# Altium project DIOT_Template.PrjPCB (part 3 of 3)

## Sheet FPGA_Supply.SchDoc: =DocumentName
size A4; DocumentNumber: 1; Revision: 0; SheetNumber: 17; SheetTotal: 18
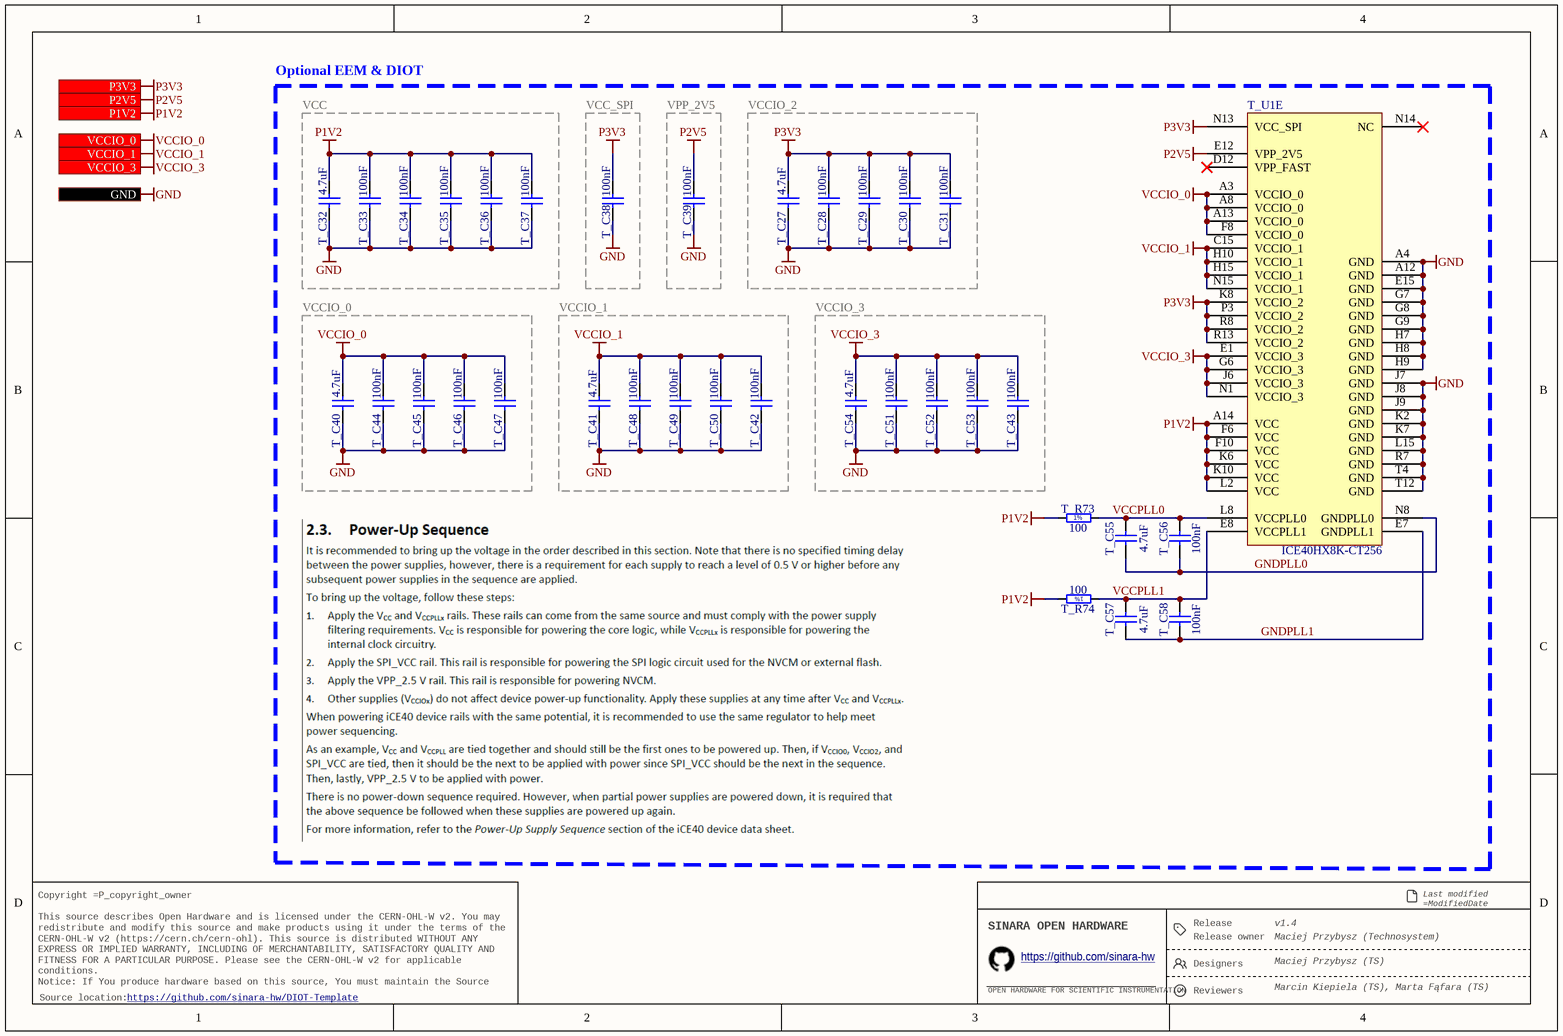
[diagram p16: FPGA_Supply.SchDoc]

### Parts
T_C27  4.7uF  [CAPC2012X135N]
T_C28  100nF  [CAPC1005X55N]
T_C29  100nF  [CAPC1005X55N]
T_C30  100nF  [CAPC1005X55N]
T_C31  100nF  [CAPC1005X55N]
T_C32  4.7uF  [CAPC2012X135N]
T_C33  100nF  [CAPC1005X55N]
T_C34  100nF  [CAPC1005X55N]
T_C35  100nF  [CAPC1005X55N]
T_C36  100nF  [CAPC1005X55N]
T_C37  100nF  [CAPC1005X55N]
T_C38  100nF  [CAPC1005X55N]
T_C39  100nF  [CAPC1005X55N]
T_C40  4.7uF  [CAPC2012X135N]
T_C41  4.7uF  [CAPC2012X135N]
T_C42  100nF  [CAPC1005X55N]
T_C43  100nF  [CAPC1005X55N]
T_C44  100nF  [CAPC1005X55N]
T_C45  100nF  [CAPC1005X55N]
T_C46  100nF  [CAPC1005X55N]
T_C47  100nF  [CAPC1005X55N]
T_C48  100nF  [CAPC1005X55N]
T_C49  100nF  [CAPC1005X55N]
T_C50  100nF  [CAPC1005X55N]
T_C51  100nF  [CAPC1005X55N]
T_C52  100nF  [CAPC1005X55N]
T_C53  100nF  [CAPC1005X55N]
T_C54  4.7uF  [CAPC2012X135N]
T_C55  4.7uF  [CAPC2012X135N]
T_C56  100nF  [CAPC1005X55N]
T_C57  4.7uF  [CAPC2012X135N]
T_C58  100nF  [CAPC1005X55N]
T_R73  100  [RESC1005X40N]
T_R74  100  [RESC1005X40N]
T_U1  ICE40HX8K-CT256  [LATC-caBGA-256]  (part E of 5)

### Blocks framed on the sheet
Optional EEM & DIOT: T_C55-T_C58 T_R73 T_R74 T_U1
VCC: T_C32-T_C37
VCC_SPI: T_C38
VPP_2V5: T_C39
VCCIO_2: T_C27-T_C31
VCCIO_0: T_C40 T_C44-T_C47
VCCIO_1: T_C41 T_C42 T_C48-T_C50
VCCIO_3: T_C43 T_C51-T_C54

### Ports
GND, P1V2 (in), P2V5 (in), P3V3 (in), VCCIO_0 (in), VCCIO_1 (in), VCCIO_3 (in)

### Nets
GND: T_C27.1 T_C28.1 T_C29.1 T_C30.1 T_C31.1 T_C32.1 T_C33.1 T_C34.1 T_C35.1 T_C36.1 T_C37.1 T_C38.1 T_C39.1 T_C40.1 T_C41.1 T_C42.1 T_C43.1 T_C44.1 T_C45.1 T_C46.1 T_C47.1 T_C48.1 T_C49.1 T_C50.1 T_C51.1 T_C52.1 T_C53.1 T_C54.1 T_U1.A4(GND) T_U1.A12(GND) T_U1.E15(GND) T_U1.G7(GND) T_U1.G8(GND) T_U1.G9(GND) T_U1.H7(GND) T_U1.H8(GND) T_U1.H9(GND) T_U1.J7(GND) T_U1.J8(GND) T_U1.J9(GND) T_U1.K2(GND) T_U1.K7(GND) T_U1.L15(GND) T_U1.R7(GND) T_U1.T4(GND) T_U1.T12(GND) ; port GND
P1V2: T_C32.2 T_C33.2 T_C34.2 T_C35.2 T_C36.2 T_C37.2 T_R73.1 T_R74.2 T_U1.A14(VCC) T_U1.F6(VCC) T_U1.F10(VCC) T_U1.K6(VCC) T_U1.K10(VCC) T_U1.L2(VCC) ; port P1V2
P2V5: T_C39.2 T_U1.E12(VPP_2V5) ; port P2V5
P3V3: T_C27.2 T_C28.2 T_C29.2 T_C30.2 T_C31.2 T_C38.2 T_U1.K8(VCCIO_2) T_U1.N13(VCC_SPI) T_U1.P3(VCCIO_2) T_U1.R8(VCCIO_2) T_U1.R13(VCCIO_2) ; port P3V3
VCCIO_0: T_C40.2 T_C44.2 T_C45.2 T_C46.2 T_C47.2 T_U1.A3(VCCIO_0) T_U1.A8(VCCIO_0) T_U1.A13(VCCIO_0) T_U1.F8(VCCIO_0) ; port VCCIO_0
VCCIO_1: T_C41.2 T_C42.2 T_C48.2 T_C49.2 T_C50.2 T_U1.C15(VCCIO_1) T_U1.H10(VCCIO_1) T_U1.H15(VCCIO_1) T_U1.N15(VCCIO_1) ; port VCCIO_1
VCCIO_3: T_C43.2 T_C51.2 T_C52.2 T_C53.2 T_C54.2 T_U1.E1(VCCIO_3) T_U1.G6(VCCIO_3) T_U1.J6(VCCIO_3) T_U1.N1(VCCIO_3) ; port VCCIO_3
GNDPLL0: T_C55.1 T_C56.1 T_U1.N8(GNDPLL0)
GNDPLL1: T_C57.1 T_C58.1 T_U1.E7(GNDPLL1)
VCCPLL0: T_C55.2 T_C56.2 T_R73.2 T_U1.L8(VCCPLL0)
VCCPLL1: T_C57.2 T_C58.2 T_R74.1 T_U1.E8(VCCPLL1)

Not connected (* = marked no-connect by the designer): T_U1 D12(VPP_FAST)* N14(NC)*

### Notes on the sheet
- Release
- Last modified =ModifiedDate
  Sheet =sheetnumber of =sheettotal · Size A4
- Copyright =P_copyright_owner
  This source describes Open Hardware and is licensed under the CERN-OHL-W v2. You may redistribute and modify this source and make products using it under the terms of the CERN-OHL-W v2 (https://cern.ch/cern-ohl). This source is distributed WITHOUT ANY EXPRESS OR IMPLIED WARRANTY, INCLUDING OF MERCHANTABILITY, SATISFACTORY QUALITY AND FITNESS FOR A PARTICULAR PURPOSE. Please see the CERN-OHL-W v2 for applicable conditions.
  Notice: If You produce hardware based on this source, You must maintain the Source Location visible on the product, its packaging or its documentation.
- SINARA OPEN HARDWARE
- OPEN HARDWARE FOR SCIENTIFIC INSTRUMENTATION
- https://github.com/sinara-hw
- Release owner
- Designers
- Reviewers
- Source location:
- (in symbol R0402_100R_1%_0.0625W_100PPM) 1%

### Library data of the parts
T_C27 T_C32 T_C40 T_C41 T_C54 T_C55 T_C57 = CC0805_4.7UF_16V_10%_X7R: Non-polarised capacitor; Part Description: SMD Multilayer Chip Ceramic Capacitor; Manufacturer: GENERIC; Manufacturer1 Part Number: EMK212B7475KG-T; Voltage: 16V; TC: X7R; Tolerance: ±10%; Part Number: CC0805_4.7UF_16V_10%_X7R; Component Kind: Standard; Component Type: Standard; Pin Count: 2; Value: 4.7uF; Status: Preferred; Manufacturer Part Number: CC0805_4.7UF_16V_10%_X7R; Case: 0805; Mounted: Yes; Socket: No; SMD: Yes; Sense: No; Manufacturer1 Example: TAIYO YUDEN; Manufacturer1 ComponentHeight: 1.35mm; HelpURL: \\cern.ch\dfs\Applications\Altium\Datasheets\CC0805_X7R_TAIYO-YUDEN_HIGH-VALUE.pdf; Author: CERN DEM JLC; CreateDate: 16.09.2014; LatestRevisionDate: 16.09.2014
T_C28-T_C31 T_C33-T_C39 T_C42-T_C53 T_C56 T_C58 = CC0402_100NF_50V_10%_X7R: Non-polarised capacitor; Part Description: SMD Multilayer Chip Ceramic Capacitor; Manufacturer: GENERIC; Manufacturer1 Part Number: GRM155R71H104KE14D; Voltage: 50V; TC: X7R; Tolerance: ±10%; Part Number: CC0402_100NF_50V_10%_X7R; Component Kind: Standard; Component Type: Standard; Pin Count: 2; Value: 100nF; Status: None; Manufacturer Part Number: CC0402_100NF_50V_10%_X7R; Case: 0402; Mounted: Yes; Socket: No; SMD: Yes; Manufacturer1 Example: MURATA; Manufacturer1 ComponentHeight: 0.55mm; HelpURL: \\cern.ch\dfs\Applications\Altium\Datasheets\CC0402_MURATA_GRM155R71H104KE14D.pdf; Author: CERN DEM MR; CreateDate: 30.06.2017; LatestRevisionDate: 30.06.2017; Sense: No
T_R73 T_R74 = R0402_100R_1%_0.0625W_100PPM: Resistor - 1%; Part Description: General Purpose Thick Film Chip Resistor; Manufacturer: GENERIC; Manufacturer1 Part Number: 232270671001L; TC: ±100ppm/°C; Table: Resistors SMD; Part Number: R0402_100R_1%_0.0625W_100PPM; Component Kind: Standard; Component Type: Standard; Pin Count: 2; Value: 100; Status: Not recommended; Power: 0.0625W; Tolerance: ±1%; Manufacturer Part Number: R0402_100R_1%_0.0625W_100PPM; Case: 0402; Mounted: Yes; Socket: No; SMD: Yes; Manufacturer1 Example: YAGEO PHYCOMP; Manufacturer1 ComponentHeight: 0.4mm; HelpURL: \\cern.ch\dfs\Applications\Altium\Datasheets\R0402_Phycomp_RC0402.pdf; Author: CERN DEM JLC; CreateDate: 2007-12-03; LatestRevisionDate: 2012-10-17
T_U1 = CMP-0962-00001-1: iCE40 HX8K Series FPGA Family, 7680 Logic Cells, 1.2 V Core, 128 K Embedded RAM Bits, 256-ball caBGA, Pb-Free, Tray; Manufacturer: Lattice Semiconductor; Supply Voltage: 1.2V; Phase-Locked Loops: 2; Logic Cells: 7680; Embedded RAM Bits: 128K; PackageReference: caBGA-256; PackageDescription: 256-Ball Chip Array Ball Grid Array, Body 14 x 14 mm, Pitch 0.8 mm; RoHS: TRUE; Packing: Tray; Mounting Technology: Surface Mount; ComponentLink3URL: http://www.latticesemi.com/lit/docs/package/pkg.pdf; ComponentLink1Description: Manufacturer URL; ComponentLink3Description: Package Specification; Code_JEDEC: MO-275; PackageVersion: Rev. 03.9, 02/2013; ComponentLink1URL: http://www.latticesemi.com/en; ComponentLink2URL: http://www.latticesemi.com/~/media/Documents/DataSheets/iCE/iCE40LPHXFamilyDataSheet.pdf; Manufacturer Part Number: ICE40HX8K-CT256; ComponentLink2Description: Datasheet; DatasheetVersion: Rev. 02.9

## Sheet FPGA_Config.SchDoc: =DocumentName
size A3; DocumentNumber: 1; Revision: 0; SheetNumber: 18; SheetTotal: 18
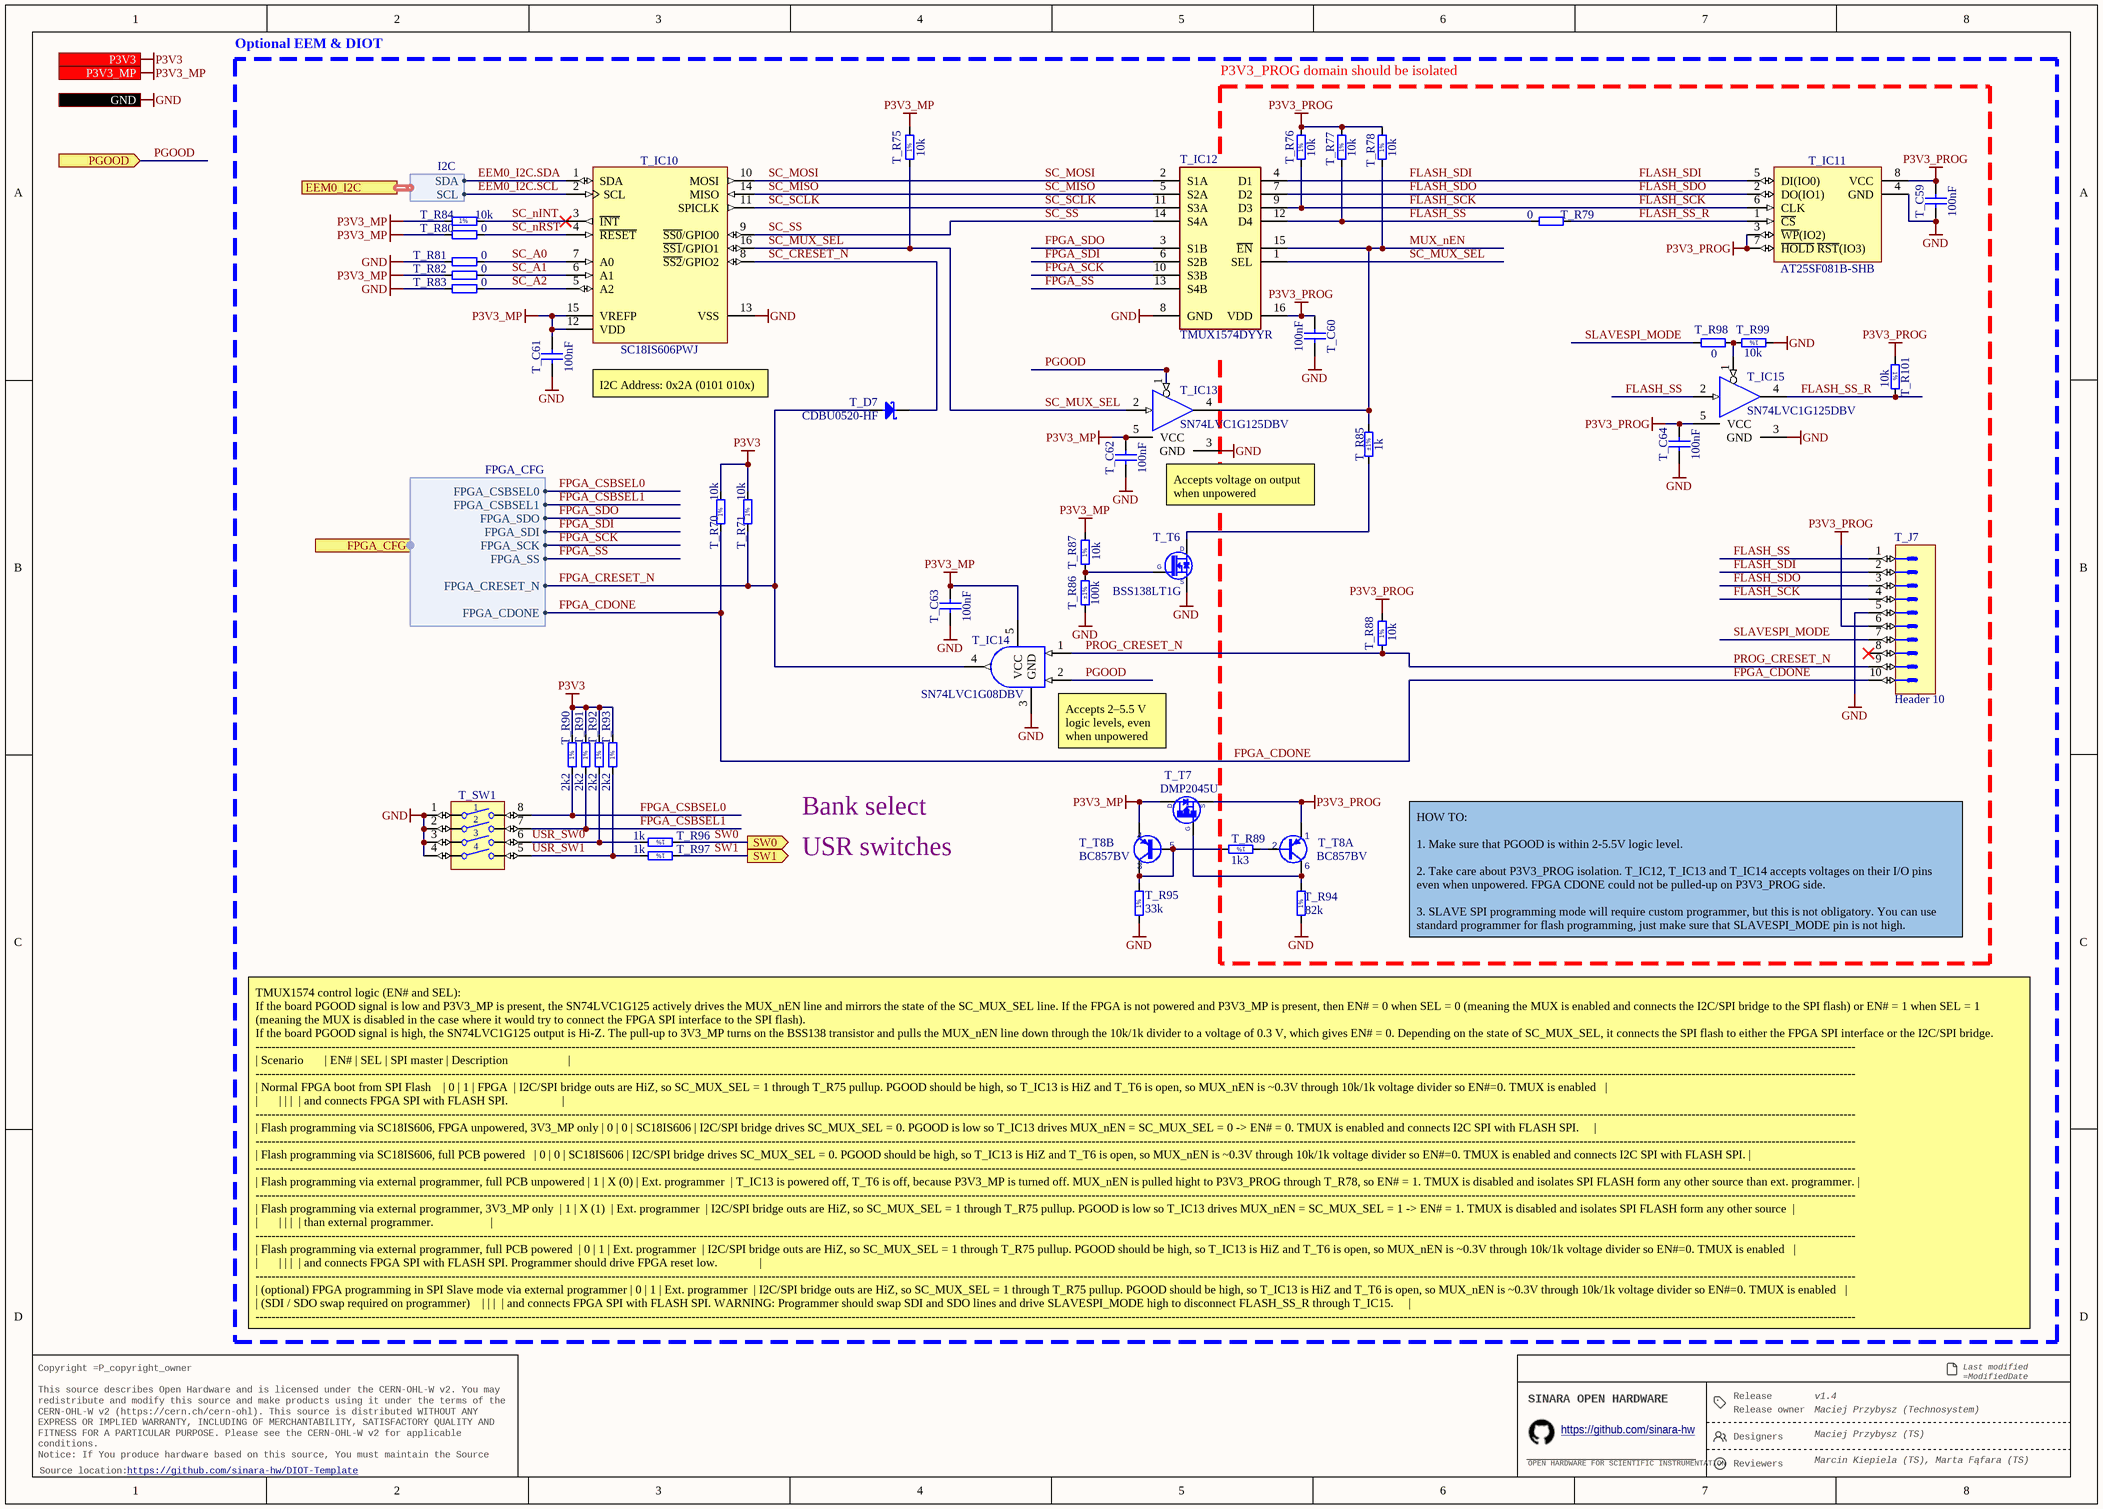
[diagram p17: FPGA_Config.SchDoc]

### Parts
T_C59  100nF  [CAPC1005X55N]
T_C60  100nF  [CAPC1005X55N]
T_C61  100nF  [CAPC1005X55N]
T_C62  100nF  [CAPC1005X55N]
T_C63  100nF  [CAPC1005X55N]
T_C64  100nF  [CAPC1005X55N]
T_D7  CDBU0520-HF  [SOD-523F]
T_IC10  SC18IS606PWJ  [SOP65P640X110-16N]
T_IC11  AT25SF081B-SHB  [SOIC127P790X216-8N]
T_IC12  TMUX1574DYYR  [SOP50P326X110-16N]
T_IC13  SN74LVC1G125DBV  [SOT95P280X145-5N]
T_IC14  SN74LVC1G08DBV  [SOT95P280X145-5N]
T_IC15  SN74LVC1G125DBV  [SOT95P280X145-5N]
T_J7  Header 10  [HARWIN_M20-9980546]
T_R70  10k  [RESC1005X40N]
T_R71  10k  [RESC1005X40N]
T_R75  10k  [RESC1005X40N]
T_R76  10k  [RESC1005X40N]
T_R77  10k  [RESC1005X40N]
T_R78  10k  [RESC1005X40N]
T_R79  0  [RESC1005X40N]
T_R80  0  [RESC1005X40N]
T_R81  0  [RESC1005X40N]
T_R82  0  [RESC1005X40N]
T_R83  0  [RESC1005X40N]
T_R84  10k  [RESC1005X40N]
T_R85  1k  Tolerance: ±1%  [RESC1005X40N]
T_R86  100k  Tolerance: ±1%  [RESC1005X40N]
T_R87  10k  [RESC1005X40N]
T_R88  10k  [RESC1005X40N]
T_R89  1k3  [RESC1608X55N]
T_R90  2k2  [RESC1005X40N]
T_R91  2k2  [RESC1005X40N]
T_R92  2k2  [RESC1005X40N]
T_R93  2k2  [RESC1005X40N]
T_R94  82k  [RESC1608X55N]
T_R95  33k  [RESC1005X40N]
T_R96  1k  [RESC1005X40N]
T_R97  1k  [RESC1005X40N]
T_R98  0  [RESC1005X40N]
T_R99  10k  [RESC1005X40N]
T_R101  10k  [RESC1005X40N]
T_SW1  Switch  [SW_TYCO_1571983-4]  (value not drawn)
T_T6  BSS138LT1G  [SOT95P240X110-3N]
T_T7  DMP2045U  [SOT95P240X110-3N]
T_T8  BC857BV  [SOTFL50P160X60-6N]  (parts A,B of 2)

### Ports
EEM0_I2C (harness I2C), FPGA_CFG (harness FPGA_CFG), GND, P3V3 (in), P3V3_MP (in), PGOOD (in), SW0 (out), SW1 (out)

### Harnesses
FPGA_CFG: FPGA_CSBSEL0, FPGA_CSBSEL1, FPGA_SDO, FPGA_SDI, FPGA_SCK, FPGA_SS, FPGA_CRESET_N, FPGA_CDONE
I2C: SDA, SCL

### Nets
GND: T_C59.1 T_C60.1 T_C61.1 T_C62.1 T_C63.1 T_C64.1 T_IC10.13(VSS) T_IC11.4(GND) T_IC12.8(GND) T_IC13.3(GND) T_IC14.3(GND) T_IC15.3(GND) T_J7.5 T_R81.2 T_R83.2 T_R86.2 T_R94.1 T_R95.1 T_R99.1 T_SW1.1 T_SW1.2 T_SW1.3 T_SW1.4 T_T6.2(S) ; port GND
P3V3: T_R70.2 T_R71.2 T_R90.2 T_R91.2 T_R92.2 T_R93.2 ; port P3V3
P3V3_MP: T_C61.2 T_C62.2 T_C63.2 T_IC10.12(VDD) T_IC10.15(VREFP) T_IC13.5(VCC) T_IC14.5(VCC) T_R75.2 T_R80.2 T_R82.2 T_R84.1 T_R87.2 T_T7.3(D) T_T8.4(E) ; port P3V3_MP
P3V3_PROG: T_C59.2 T_C60.2 T_C64.2 T_IC11.3(~{WP}(IO2)) T_IC11.7(~{HOLD}_~{RST}(IO3)) T_IC11.8(VCC) T_IC12.16(VDD) T_IC15.5(VCC) T_J7.6 T_R76.2 T_R77.2 T_R78.2 T_R88.2 T_R101.1 T_T7.2(S) T_T8.1(E)
EEM0_I2C.SCL: T_IC10.2(SCL) ; port EEM0_I2C.SCL
EEM0_I2C.SDA: T_IC10.1(SDA) ; port EEM0_I2C.SDA
FLASH_SCK: T_IC11.6(CLK) T_IC12.9(D3) T_J7.4 T_R76.1
FLASH_SDI: T_IC11.5(DI(IO0)) T_IC12.4(D1) T_J7.2
FLASH_SDO: T_IC11.2(DO(IO1)) T_IC12.7(D2) T_J7.3
FLASH_SS: T_IC12.12(D4) T_IC15.2(IN) T_J7.1 T_R77.1 T_R79.1
FLASH_SS_R: T_IC11.1(~{CS}) T_IC15.4(OUT) T_R79.2 T_R101.2
FPGA_CDONE: T_J7.10 T_R70.1 ; port FPGA_CFG.FPGA_CDONE  [project net FPGA_CFG.FPGA_CDONE]
FPGA_CRESET_N: T_D7.2(A) T_IC14.4(Y) T_R71.1 ; port FPGA_CFG.FPGA_CRESET_N  [project net FPGA_CFG.FPGA_CRESET_N]
FPGA_CSBSEL0: T_R90.1 T_SW1.8 ; port FPGA_CFG.FPGA_CSBSEL0  [project net FPGA_CFG.FPGA_CSBSEL0]
FPGA_CSBSEL1: T_R91.1 T_SW1.7 ; port FPGA_CFG.FPGA_CSBSEL1  [project net FPGA_CFG.FPGA_CSBSEL1]
FPGA_SCK: T_IC12.10(S3B) ; port FPGA_CFG.FPGA_SCK  [project net FPGA_CFG.FPGA_SCK]
FPGA_SDI: T_IC12.6(S2B) ; port FPGA_CFG.FPGA_SDI  [project net FPGA_CFG.FPGA_SDI]
FPGA_SDO: T_IC12.3(S1B) ; port FPGA_CFG.FPGA_SDO  [project net FPGA_CFG.FPGA_SDO]
FPGA_SS: T_IC12.13(S4B) ; port FPGA_CFG.FPGA_SS  [project net FPGA_CFG.FPGA_SS]
MUX_nEN: T_IC12.15(~{EN}) T_IC13.4(OUT) T_R78.1 T_R85.2
PGOOD: T_IC13.1(~{G}) T_IC14.2(B) ; port PGOOD
PROG_CRESET_N: T_IC14.1(A) T_J7.9 T_R88.1
SC_A0: T_IC10.7(A0) T_R81.1
SC_A1: T_IC10.6(A1) T_R82.1
SC_A2: T_IC10.5(A2) T_R83.1
SC_CRESET_N: T_D7.1(C) T_IC10.8(~{SS2}/GPIO2)
SC_MISO: T_IC10.14(MISO) T_IC12.5(S2A)
SC_MOSI: T_IC10.10(MOSI) T_IC12.2(S1A)
SC_MUX_SEL: T_IC10.16(~{SS1}/GPIO1) T_IC12.1(SEL) T_IC13.2(IN) T_R75.1
SC_nINT: T_IC10.3(~{INT}) T_R84.2
SC_nRST: T_IC10.4(~{RESET}) T_R80.1
SC_SCLK: T_IC10.11(SPICLK) T_IC12.11(S3A)
SC_SS: T_IC10.9(~{SS0}/GPIO0) T_IC12.14(S4A)
SLAVESPI_MODE: T_J7.7 T_R98.1
SW0: T_R96.1 ; port SW0
SW1: T_R97.1 ; port SW1
USR_SW0: T_R92.1 T_R96.2 T_SW1.6
USR_SW1: T_R93.1 T_R97.2 T_SW1.5
NetT_IC15_1: T_IC15.1(~{G}) T_R98.2 T_R99.2
NetT_R85_1: T_R85.1 T_T6.3(D)
NetT_R86_1: T_R86.1 T_R87.1 T_T6.1(G)
NetT_R89_1: T_R89.1 T_T8.2(B)
NetT_R89_2: T_R89.2 T_R95.2 T_T8.3(C) T_T8.5(B)
NetT_R94_2: T_R94.2 T_T7.1(G) T_T8.6(C)

Not connected (* = marked no-connect by the designer): T_J7 8*

### Notes on the sheet
- Optional EEM & DIOT
- P3V3_PROG domain should be isolated
- I2C Address: 0x2A (0101 010x)
- (near T_IC13) Accepts voltage on output when unpowered
- (near T_IC14) Accepts 2–5.5 V logic levels, even when unpowered
- Bank select
- USR switches
- HOW TO:
  1. Make sure that PGOOD is within 2-5.5V logic level.
  2. Take care about P3V3_PROG isolation. T_IC12, T_IC13 and T_IC14 accepts voltages on their I/O pins even when unpowered. FPGA CDONE could not be pulled-up on P3V3_PROG side.
  3. SLAVE SPI programming mode will require custom programmer, but this is not obligatory. You can use standard programmer for flash programming, just make sure that SLAVESPI_MODE pin is not high.
- TMUX1574 control logic (EN# and SEL):
  If the board PGOOD signal is low and P3V3_MP is present, the SN74LVC1G125 actively drives the MUX_nEN line and mirrors the state of the SC_MUX_SEL line. If the FPGA is not powered and P3V3_MP is present, then EN# = 0 when SEL = 0 (meaning the MUX is enabled and connects the I2C/SPI bridge to the SPI flash) or EN# = 1 when SEL = 1 (meaning the MUX is disabled in the case where it would try to connect the FPGA SPI interface to the SPI flash).
  If the board PGOOD signal is high, the SN74LVC1G125 output is Hi-Z. The pull-up to 3V3_MP turns on the BSS138 transistor and pulls the MUX_nEN line down through the 10k/1k divider to a voltage of 0.3 V, which gives EN# = 0. Depending on the state of SC_MUX_SEL, it connects the SPI flash to either the FPGA SPI interface or the I2C/SPI bridge.
  -------------------------------------------------------------------------------------------------------------------------------------------------------------------------------------------------------------------------------------------------------------------------------------------------------------------------------------------------------------------------------------------------------------------------------------------------
  | Scenario							| EN#	| SEL	| SPI master	| Description																				|
  -------------------------------------------------------------------------------------------------------------------------------------------------------------------------------------------------------------------------------------------------------------------------------------------------------------------------------------------------------------------------------------------------------------------------------------------------
  | Normal FPGA boot from SPI Flash				| 0	| 1	| FPGA		| I2C/SPI bridge outs are HiZ, so SC_MUX_SEL = 1 through T_R75 pullup. PGOOD should be high, so T_IC13 is HiZ and T_T6 is open, so MUX_nEN is ~0.3V through 10k/1k voltage divider so EN#=0. TMUX is enabled 		|
  |							|	|	|		| and connects FPGA SPI with FLASH SPI.																		|
  -------------------------------------------------------------------------------------------------------------------------------------------------------------------------------------------------------------------------------------------------------------------------------------------------------------------------------------------------------------------------------------------------------------------------------------------------
  | Flash programming via SC18IS606, FPGA unpowered, 3V3_MP only	| 0	| 0	| SC18IS606	| I2C/SPI bridge drives SC_MUX_SEL = 0. PGOOD is low so T_IC13 drives MUX_nEN = SC_MUX_SEL = 0 -> EN# = 0. TMUX is enabled and connects I2C SPI with FLASH SPI.					|
  -------------------------------------------------------------------------------------------------------------------------------------------------------------------------------------------------------------------------------------------------------------------------------------------------------------------------------------------------------------------------------------------------------------------------------------------------
  | Flash programming via SC18IS606, full PCB powered			| 0	| 0	| SC18IS606	| I2C/SPI bridge drives SC_MUX_SEL = 0. PGOOD should be high, so T_IC13 is HiZ and T_T6 is open, so MUX_nEN is ~0.3V through 10k/1k voltage divider so EN#=0. TMUX is enabled and connects I2C SPI with FLASH SPI.	|
  -------------------------------------------------------------------------------------------------------------------------------------------------------------------------------------------------------------------------------------------------------------------------------------------------------------------------------------------------------------------------------------------------------------------------------------------------
  | Flash programming via external programmer, full PCB unpowered	| 1	| X (0)	| Ext. programmer 	| T_IC13 is powered off, T_T6 is off, because P3V3_MP is turned off. MUX_nEN is pulled hight to P3V3_PROG through T_R78, so EN# = 1. TMUX is disabled and isolates SPI FLASH form any other source than ext. programmer.	|
  -------------------------------------------------------------------------------------------------------------------------------------------------------------------------------------------------------------------------------------------------------------------------------------------------------------------------------------------------------------------------------------------------------------------------------------------------
  | Flash programming via external programmer, 3V3_MP only		| 1	| X (1) 	| Ext. programmer 	| I2C/SPI bridge outs are HiZ, so SC_MUX_SEL = 1 through T_R75 pullup. PGOOD is low so T_IC13 drives MUX_nEN = SC_MUX_SEL = 1 -> EN# = 1. TMUX is disabled and isolates SPI FLASH form any other source		|
  |							|	|	|		| than external programmer.																			|
  -------------------------------------------------------------------------------------------------------------------------------------------------------------------------------------------------------------------------------------------------------------------------------------------------------------------------------------------------------------------------------------------------------------------------------------------------
  | Flash programming via external programmer, full PCB powered		| 0	| 1	| Ext. programmer 	| I2C/SPI bridge outs are HiZ, so SC_MUX_SEL = 1 through T_R75 pullup. PGOOD should be high, so T_IC13 is HiZ and T_T6 is open, so MUX_nEN is ~0.3V through 10k/1k voltage divider so EN#=0. TMUX is enabled 		|
  |							|	|	|		| and connects FPGA SPI with FLASH SPI. Programmer should drive FPGA reset low.														|
  -------------------------------------------------------------------------------------------------------------------------------------------------------------------------------------------------------------------------------------------------------------------------------------------------------------------------------------------------------------------------------------------------------------------------------------------------
  | (optional) FPGA programming in SPI Slave mode via external programmer	| 0	| 1	| Ext. programmer 	| I2C/SPI bridge outs are HiZ, so SC_MUX_SEL = 1 through T_R75 pullup. PGOOD should be high, so T_IC13 is HiZ and T_T6 is open, so MUX_nEN is ~0.3V through 10k/1k voltage divider so EN#=0. TMUX is enabled 		|
  | (SDI / SDO swap required on programmer)				|	|	|		| and connects FPGA SPI with FLASH SPI. WARNING: Programmer should swap SDI and SDO lines and drive SLAVESPI_MODE high to disconnect FLASH_SS_R through T_IC15.					|
  -------------------------------------------------------------------------------------------------------------------------------------------------------------------------------------------------------------------------------------------------------------------------------------------------------------------------------------------------------------------------------------------------------------------------------------------------
- Release
- Last modified =ModifiedDate
  Sheet =sheetnumber of =sheettotal · Size A3
- Copyright =P_copyright_owner
  This source describes Open Hardware and is licensed under the CERN-OHL-W v2. You may redistribute and modify this source and make products using it under the terms of the CERN-OHL-W v2 (https://cern.ch/cern-ohl). This source is distributed WITHOUT ANY EXPRESS OR IMPLIED WARRANTY, INCLUDING OF MERCHANTABILITY, SATISFACTORY QUALITY AND FITNESS FOR A PARTICULAR PURPOSE. Please see the CERN-OHL-W v2 for applicable conditions.
  Notice: If You produce hardware based on this source, You must maintain the Source Location visible on the product, its packaging or its documentation.
- SINARA OPEN HARDWARE
- OPEN HARDWARE FOR SCIENTIFIC INSTRUMENTATION
- https://github.com/sinara-hw
- Release owner
- Designers
- Reviewers
- Source location:
- (in symbol R0402_1K_1%_0.0625W_100PPM) 1%
- (in symbol R0402_2K2_1%_0.0625W_100PPM) 1%
- (in symbol R0402_10K_1%_0.0625W_100PPM) 1%
- (in symbol R0402_33K_1%_0.0625W_100PPM) 1%
- (in symbol R0603_1K3_1%_0.1W_100PPM) 1%
- (in symbol R0603_82K_1%_0.1W_100PPM) 1%

### Library data of the parts
T_C59-T_C64 = CC0402_100NF_50V_10%_X7R: as T_C28 on sheet FPGA_Supply; Part Number: CC0402_100NF_50V_10%_X7R; Component Kind: Standard; Component Type: Standard; Pin Count: 2; Value: 100nF; Status: None; Manufacturer Part Number: CC0402_100NF_50V_10%_X7R; Case: 0402; Mounted: Yes; Socket: No; SMD: Yes; Sense: No; Manufacturer1 Example: MURATA; Manufacturer1 ComponentHeight: 0.55mm; HelpURL: \\cern.ch\dfs\Applications\Altium\Datasheets\CC0402_MURATA_GRM155R71H104KE14D.pdf; Author: CERN DEM MR; CreateDate: 30.06.2017; LatestRevisionDate: 30.06.2017
T_D7 = CDBU0520-HF: Schottky Diode; Part Description: 20V Surface mount Schottky Barrier Diode; Manufacturer: COMCHIP; Voltage: 20V; Power: 500mA; PressFit: No; Bonding: No; Part Number: CDBU0520-HF; Component Kind: Standard; Component Type: Standard; Device: CDBU0520-HF; PackageDescription: Small Outline Diode Flat Lead (SOD-523F), Body; 1.80mm L X 1mm W X 0.85mm H; Manufacturer Part Number: CDBU0520-HF; Pin Count: 2; Case: SOD-523F; Mounted: Yes; Socket: No; SMD: Yes; Sense: No; ComponentHeight: 1mm; HelpURL: \\cern.ch\dfs\Applications\Altium\Datasheets\CDBU0520-HF.pdf; Author: CERN DEM HF; CreateDate: 13.10.2023; LatestRevisionDate: 13.10.2023
T_IC10 = SC18IS606PWJ: I2C-bus to SPI bridge; Manufacturer: NXP SEMICONDUCTORS; PressFit: No; Bonding: No; Part Number: SC18IS606PWJ; Component Kind: Standard; Component Type: Standard; Device: SC18IS606PWJ; PackageDescription: SOP, 0.65mm pitch; 16 pin, 4.40mm W X 5.00mm L X 1.10mm H body IPC Medium Density; Part Description: I2C-Bus to SPI Bridge; Manufacturer Part Number: SC18IS606PWJ; Pin Count: 16; Case: TSSOP16; Mounted: Yes; Socket: No; SMD: Yes; Sense: No; ComponentHeight: 1.1mm; HelpURL: \\cern.ch\dfs\Applications\Altium\Datasheets\SC18IS602B.pdf; Author: GK; CreateDate: 14/12/2015; LatestRevisionDate: 14/12/2015
T_IC11 = MEM_AT25SF081B-SHB: 8M-bit Serial Flash Memory with uniform 4KB sectors and Dual/Quad SPI and QPI; Manufacturer: Renesas; PressFit: No; Bonding: No; Part Number: AT25SF081B-SHB; Component Kind: Standard; Component Type: Standard; Device: AT25SF081B-SHB; PackageDescription: SOIC, 1.27mm Pitch; 8 Pin, 5.285mm W X 5.335mm L X 2.16mm H body, IPC Medium Density; Part Description: 8M-bit Serial Flash Memory with uniform 4KB sectors and Dual/Quad SPI and QPI; Manufacturer Part Number: AT25SF081B-SHB; Pin Count: 8; Case: SOIC8; Mounted: Yes; Socket: No; SMD: Yes; Sense: No; ComponentHeight: 2.16mm; HelpURL: \\cern.ch\dfs\Applications\Altium\Datasheets\W25Q128FVSIG.pdf; Author: GK; CreateDate: 26/01/2018; LatestRevisionDate: 26/01/2018
T_IC12 = TMUX1574DYYR: Integrated Circuit; Manufacturer_Name: Texas Instruments; Datasheet Link: https://www.ti.com/lit/gpn/TMUX1574; Height: 1.1mm; Manufacturer_Part_Number: TMUX1574DYYR; Mouser Part Number: 595-TMUX1574DYYR; Mouser Price/Stock: https://www.mouser.co.uk/ProductDetail/Texas-Instruments/TMUX1574DYYR?qs=B6kkDfuK7%2FDgs0e8M6dtlw%3D%3D; Arrow Part Number: TMUX1574DYYR; Arrow Price/Stock: https://www.arrow.com/en/products/tmux1574dyyr/texas-instruments.html?utm_currency=USD&region=nac
T_IC13 T_IC15 = SN74LVC1G125DBV: Single Bus Buffer Gate With 3-State Output; Part Description: Single Bus Buffer Gate with 3-State Outputs; Manufacturer: TEXAS INSTRUMENTS; PressFit: No; Bonding: No; Part Number: SN74LVC1G125DBV; Component Kind: Standard; Component Type: Standard; Device: SN74LVC1G125DBV; PackageDescription: SOT, 0.95mm Pitch; 5 Pin, 1.60mm W X 2.90mm L X 1.45mm H body, IPC Medium Density; Manufacturer Part Number: SN74LVC1G125DBV; Pin Count: 5; Case: SOT23-5; Mounted: Yes; Socket: No; SMD: Yes; Sense: No; ComponentHeight: 1.45mm; Author: CERN DEM HF; HelpURL: \\cern.ch\dfs\Applications\Altium\Datasheets\SN74LVC1G125.pdf; CreateDate: 15.11.2022; LatestRevisionDate: 15.11.2022
T_IC14 = SN74LVC1G08DBV: Single 2-Input AND Gate; Part Description: Single 2-Input Positive-AND Gate; Manufacturer: TEXAS INSTRUMENTS; PressFit: No; Bonding: No; Part Number: SN74LVC1G08DBV; Component Kind: Standard; Component Type: Standard; Device: SN74LVC1G08DBV; PackageDescription: SOT, 0.95mm Pitch; 5 Pin, 1.60mm W X 2.90mm L X 1.45mm H body, IPC Medium Density; Manufacturer Part Number: SN74LVC1G08DBV; Pin Count: 5; Case: SOT23-5; Mounted: Yes; Socket: No; SMD: Yes; Sense: No; ComponentHeight: 1.45mm; Author: CERN DEM JLC; HelpURL: \\cern.ch\dfs\Applications\Altium\Datasheets\SN74LVC1G08.pdf; CreateDate: 28.08.2012; LatestRevisionDate: 27.10.2021
T_J7 = HARWIN_M20-9980546: Connector 10 Male; Part Description: 10 Contacts - Pitch 2.54mm - Dual Row Straight Header (Lead Length 6.1mm, Insulator 2.54mm); Manufacturer: HARWIN; PressFit: No; Part Number: HARWIN_M20-9980546; Component Kind: Standard; Component Type: Standard; Pin Count: 10; Family: Header 10; Mounted: Yes; Socket: No; SMD: No; Sense: No; Status: None; Manufacturer Part Number: M20-9980546; ComponentHeight: 8.64mm; HelpURL: \\cern.ch\dfs\Applications\Altium\Datasheets\HARWIN_M20-9980546.pdf; Author: CERN DEM MR; CreateDate: 9/15/2017; LatestRevisionDate: 9/15/2017
T_R70 T_R71 = R0402_10K_1%_0.0625W_100PPM: Resistor - 1%; Part Description: General Purpose Thick Film Chip Resistor; Manufacturer: GENERIC; Manufacturer1 Part Number: 232270671003L; TC: ±100ppm/°C; PressFit: No; Part Number: R0402_10K_1%_0.0625W_100PPM; Component Kind: Standard; Component Type: Standard; Pin Count: 2; Value: 10k; Status: Not Recommended; Power: 0.0625W; Tolerance: ±1%; Manufacturer Part Number: R0402_10K_1%_0.0625W_100PPM; Case: 0402; Mounted: Yes; Sense: No; Socket: No; SMD: Yes; Manufacturer1 Example: YAGEO PHYCOMP; Manufacturer1 ComponentHeight: 0.4mm; HelpURL: \\cern.ch\dfs\Applications\Altium\Datasheets\R0402_Phycomp_RC0402.pdf; Author: CERN DEM JLC; CreateDate: 03.12.2007; LatestRevisionDate: 17.10.2012
T_R75-T_R78 T_R84 T_R87 T_R88 T_R99 T_R101 = R0402_10K_1%_0.0625W_100PPM: Resistor - 1%; Part Description: General Purpose Thick Film Chip Resistor; Manufacturer: GENERIC; Manufacturer1 Part Number: 232270671003L; TC: ±100ppm/°C; Table: Resistors SMD; Part Number: R0402_10K_1%_0.0625W_100PPM; Component Kind: Standard; Component Type: Standard; Pin Count: 2; Value: 10k; Status: Not recommended; Power: 0.0625W; Tolerance: ±1%; Manufacturer Part Number: R0402_10K_1%_0.0625W_100PPM; Case: 0402; Mounted: Yes; Socket: No; SMD: Yes; Manufacturer1 Example: YAGEO PHYCOMP; Manufacturer1 ComponentHeight: 0.4mm; HelpURL: \\cern.ch\dfs\Applications\Altium\Datasheets\R0402_Phycomp_RC0402.pdf; Author: CERN DEM JLC; CreateDate: 2007-12-03; LatestRevisionDate: 2012-10-17
T_R79-T_R83 T_R98 = R0402_0R_JUMPER: Resistor; Part Description: 1A (0.05R Max DC Resistance) Zero Ohm Jumper; Manufacturer: GENERIC; Manufacturer1 Part Number: 232270591001L; PressFit: No; Part Number: R0402_0R_JUMPER; Component Kind: Standard; Component Type: Standard; Pin Count: 2; Value: 0; Status: Not Recommended; Manufacturer Part Number: R0402_0R_JUMPER; Case: 0402; Mounted: Yes; Sense: No; Socket: No; SMD: Yes; Manufacturer1 Example: YAGEO PHYCOMP; Manufacturer1 ComponentHeight: 0.4mm; HelpURL: \\cern.ch\dfs\Applications\Altium\Datasheets\R0402_Phycomp_RC0402.pdf; Author: CERN DEM JLC; CreateDate: 03.12.2007; LatestRevisionDate: 17.10.2012
T_R85 T_R96 T_R97 = R0402_1K_1%_0.0625W_100PPM: Resistor - 1%; Part Description: General Purpose Thick Film Chip Resistor; Manufacturer: GENERIC; Manufacturer1 Part Number: 232270671002L; TC: ±100ppm/°C; PressFit: No; Part Number: R0402_1K_1%_0.0625W_100PPM; Component Kind: Standard; Component Type: Standard; Pin Count: 2; Value: 1k; Status: Not Recommended; Power: 0.0625W; Manufacturer Part Number: R0402_1K_1%_0.0625W_100PPM; Case: 0402; Mounted: Yes; Sense: No; Socket: No; SMD: Yes; Manufacturer1 Example: YAGEO PHYCOMP; Manufacturer1 ComponentHeight: 0.4mm; HelpURL: \\cern.ch\dfs\Applications\Altium\Datasheets\R0402_Phycomp_RC0402.pdf; Author: CERN DEM JLC; CreateDate: 03.12.2007; LatestRevisionDate: 17.10.2012
  T_R96 T_R97: Tolerance: ±1%
T_R86 = R0402_100K_1%_0.0625W_100PPM: Resistor - 1%; Part Description: General Purpose Thick Film Chip Resistor; Manufacturer: GENERIC; Manufacturer1 Part Number: 232270671004L; TC: ±100ppm/°C; PressFit: No; Part Number: R0402_100K_1%_0.0625W_100PPM; Component Kind: Standard; Component Type: Standard; Pin Count: 2; Value: 100k; Status: Not Recommended; Power: 0.0625W; Manufacturer Part Number: R0402_100K_1%_0.0625W_100PPM; Case: 0402; Mounted: Yes; Sense: No; Socket: No; SMD: Yes; Manufacturer1 Example: YAGEO PHYCOMP; Manufacturer1 ComponentHeight: 0.4mm; HelpURL: \\cern.ch\dfs\Applications\Altium\Datasheets\R0402_Phycomp_RC0402.pdf; Author: CERN DEM JLC; CreateDate: 03.12.2007; LatestRevisionDate: 17.10.2012
T_R89 = R0603_1K3_1%_0.1W_100PPM: Resistor - 1%; Part Description: General Purpose Thick Film Chip Resistor; Manufacturer: GENERIC; Manufacturer1 Part Number: NRC06F1301TRF; Power: 0.1W; TC: ±100ppm/°C; PressFit: No; Part Number: R0603_1K3_1%_0.1W_100PPM; Component Kind: Standard; Component Type: Standard; Pin Count: 2; Value: 1k3; Status: Preferred; Tolerance: ±1%; Manufacturer Part Number: R0603_1K3_1%_0.1W_100PPM; Case: 0603; Mounted: Yes; Sense: No; Socket: No; SMD: Yes; Manufacturer1 Example: NIC COMPONENT; Manufacturer1 ComponentHeight: 0.55mm; HelpURL: \\cern.ch\dfs\Applications\Altium\Datasheets\R0603_NIC_NRC.pdf; Author: CERN DEM JLC; CreateDate: 03.12.2007; LatestRevisionDate: 13.03.2008
T_R90-T_R93 = R0402_2K2_1%_0.0625W_100PPM: Resistor - 1%; Part Description: General Purpose Thick Film Chip Resistor; Manufacturer: GENERIC; Manufacturer1 Part Number: 232270672202L; TC: ±100ppm/°C; Table: Resistors SMD; Part Number: R0402_2K2_1%_0.0625W_100PPM; Component Kind: Standard; Component Type: Standard; Pin Count: 2; Value: 2k2; Status: Not recommended; Power: 0.0625W; Tolerance: ±1%; Manufacturer Part Number: R0402_2K2_1%_0.0625W_100PPM; Case: 0402; Mounted: Yes; Socket: No; SMD: Yes; Manufacturer1 Example: YAGEO PHYCOMP; Manufacturer1 ComponentHeight: 0.4mm; HelpURL: \\cern.ch\dfs\Applications\Altium\Datasheets\R0402_Phycomp_RC0402.pdf; Author: CERN DEM JLC; CreateDate: 2007-12-03; LatestRevisionDate: 2012-10-17
T_R94 = R0603_82K_1%_0.1W_100PPM: Resistor - 1%; Part Description: General Purpose Thick Film Chip Resistor; Manufacturer: GENERIC; Manufacturer1 Part Number: NRC06F8202TRF; Power: 0.1W; TC: ±100ppm/°C; Part Number: R0603_82K_1%_0.1W_100PPM; Component Kind: Standard; Component Type: Standard; Pin Count: 2; Value: 82k; Status: Preferred; Tolerance: ±1%; Manufacturer Part Number: R0603_82K_1%_0.1W_100PPM; Case: 0603; Mounted: Yes; Sense: No; Socket: No; SMD: Yes; Manufacturer1 Example: NIC COMPONENT; Manufacturer1 ComponentHeight: 0.55mm; HelpURL: \\cern.ch\dfs\Applications\Altium\Datasheets\R0603_NIC_NRC.pdf; Author: CERN DEM JLC; CreateDate: 03.12.2007; LatestRevisionDate: 13.03.2008
T_R95 = R0402_33K_1%_0.0625W_100PPM: Resistor - 1%; Part Description: General Purpose Thick Film Chip Resistor; Manufacturer: GENERIC; Manufacturer1 Part Number: 232270673303L; TC: ±100ppm/°C; PressFit: No; Part Number: R0402_33K_1%_0.0625W_100PPM; Component Kind: Standard; Component Type: Standard; Pin Count: 2; Value: 33k; Status: Not Recommended; Power: 0.0625W; Tolerance: ±1%; Manufacturer Part Number: R0402_33K_1%_0.0625W_100PPM; Case: 0402; Mounted: Yes; Sense: No; Socket: No; SMD: Yes; Manufacturer1 Example: YAGEO PHYCOMP; Manufacturer1 ComponentHeight: 0.4mm; HelpURL: \\cern.ch\dfs\Applications\Altium\Datasheets\R0402_Phycomp_RC0402.pdf; Author: CERN DEM JLC; CreateDate: 03.12.2007; LatestRevisionDate: 17.10.2012
T_SW1 = SW_TYCO_1571983-4: 4 Ways SPST DIP Switch; Part Description: 4 Way SPST SMD DIP Switch, Latched, Contact Rating 0.025A 24VDC; Manufacturer: TYCO; Manufacturer Part Number: 1571983-4 or GDH04S04; PressFit: No; Part Number: SW_TYCO_1571983-4; Component Kind: Standard; Component Type: Standard; Pin Count: 8; PackageDescription: Pitch 1.27mm,  Body 6.2x6.2mm, 4 Ways SPST Surface-Mount DIP Switch, TYCO GDH Series; Family: Switch; Mounted: Yes; Socket: No; SMD: Yes; Sense: No; Status: None; ComponentHeight: 2.31mm; HelpURL: \\cern.ch\dfs\Applications\Altium\Datasheets\SW_TYCO_1571983-4.pdf; Author: CERN DEM JLC; CreateDate: 08/01/2009; LatestRevisionDate: 08/01/2009
T_T6 = BSS138LT1G: N-CHANNEL MOSFET WITH DIODE; Part Description: 50V, 200mA N-Channel Enhancement Mode Field-Effect Transistor; Manufacturer: ON SEMICONDUCTOR; PressFit: No; Bonding: No; Part Number: BSS138LT1G; Component Kind: Standard; Component Type: Standard; Device: BSS138LT1G; PackageDescription: SOT23, 0.95mm Pitch; 3 Pin, 1.40mm W X 3.00mm L X 1.10mm H body, IPC Medium Density; Manufacturer Part Number: BSS138L; Pin Count: 3; Case: SOT23-3; Mounted: Yes; Socket: No; SMD: Yes; Sense: No; ComponentHeight: 1.11mm; HelpURL: \\cern.ch\dfs\Applications\Altium\Datasheets\BSS138LT1G.pdf; Author: CERN DEM JLC; CreateDate: 23.03.2009; LatestRevisionDate: 25.05.2022
T_T7 = DMP2045U: P-CHANNEL MOSFET WITH DIODE; Part Description: 20V, 4.3A, P-Channel Enhancement Mode MOSFET; Manufacturer: DIODES INCORPORATED; PressFit: No; Bonding: No; Part Number: DMP2045U; Component Kind: Standard; Component Type: Standard; Device: DMP2045U; PackageDescription: SOT23, 0.95mm Pitch; 3 Pin, 1.40mm W X 3.00mm L X 1.10mm H body, IPC Medium Density; Manufacturer Part Number: DMP2045U; Pin Count: 3; Case: SOT23-3; Mounted: Yes; Socket: No; SMD: Yes; Sense: No; ComponentHeight: 1.4mm; HelpURL: \\cern.ch\dfs\Applications\Altium\Datasheets\DMP2045U.pdf; Author: CERN DEM HF; CreateDate: 24.09.2025; LatestRevisionDate: 24.09.2025
T_T8 = BC857BV: 45V, 100mA PNP General Purpose Double Transistor; Part Description: -45V -100mA PNP General Purpose Double Transistor; Manufacturer: NXP SEMICONDUCTORS; PressFit: No; Bonding: No; Part Number: BC857BV; Component Kind: Standard; Component Type: Standard; Device: BC857BV; PackageDescription: SOTFL (SOT666), 0.50mm, Pitch; 6 Pin, 1.20mm W X 1.60mm L X 0.60mm H Body, IPC Medium Density; Manufacturer Part Number: BC857BV; Pin Count: 6; Case: SOT666; Mounted: Yes; Socket: No; SMD: Yes; Sense: No; ComponentHeight: 0.6mm; HelpURL: \\cern.ch\dfs\Applications\Altium\Datasheets\BC857BV.pdf; Author: CERN DEM JLC; CreateDate: 01/12/2011; LatestRevisionDate: 01/12/2011

## Nets that join several sheets
GND: Power_Supplies (T_C1.1 T_C2.1 T_IC1.2 T_R7.1), Power-up_delay (9 pins), LEDs (6 pins), CPCIS_Connectors_P1_P6 (57 pins), DIOT_signal_routing (T_C22.1 T_C23.1 T_IC8.4), EEM_Connectors (34 pins), CLK_GEN (T_J3.2 T_TR1.6), Temperature_monitoring (T_C8.1 T_IC6.2 T_R25.1), PWR_input_connector (T_C9.1 T_C10.1 T_D5.2 T_FL1.4), Mechanical (T_C12.2 T_R26.2 T_R27.2), I2C_switch (T_C24.1 T_C25.1 T_IC9.4 T_R69.1), FPGA_Bank2-3 (T_C26.1 T_OSC1.2), FPGA_Supply (46 pins), FPGA_Config (24 pins)
P3V3: LEDs (T_R5.2 T_R100.2 T_TP2.1), I2C_switch (6 pins), FPGA_Bank2-3 (T_C26.2 T_OSC1.1 T_OSC1.4), FPGA_Supply (11 pins), FPGA_Config (6 pins)
P3V3_MP: Power_Supplies (T_R2.2 T_R8.2), Power-up_delay (6 pins), LEDs (T_R1.2 T_R6.2 T_TP3.1), DIOT_signal_routing (T_C22.2 T_C23.2 T_IC8.1 T_IC8.8), EEM_Connectors (5 pins), Temperature_monitoring (T_C8.2 T_IC6.5), I2C_switch (T_C24.2 T_IC9.8), FPGA_Config (14 pins)
P12V0: Power_Supplies (T_C1.2 T_IC1.1 T_R4.1), Power-up_delay (T_R29.1), LEDs (T_R3.1 T_TP1.1), CPCIS_Connectors_P1_P6 (7 pins), EEM_Connectors (T_J1.28 T_J1.29 T_J2.28 T_J2.29), PWR_input_connector (T_C9.2 T_C10.2 T_D5.1 T_FL1.2)
BP_CLK.CLK_N: CPCIS_Connectors_P1_P6 (T_J4.F4), CLK_GEN (T_R12.1)
BP_CLK.CLK_P: CPCIS_Connectors_P1_P6 (T_J4.E4), CLK_GEN (T_R11.1)
BP_I2C.SCL: CPCIS_Connectors_P1_P6 (T_D2.3 T_J4.B2), DIOT_signal_routing (T_IC8.6)
BP_I2C.SDA: CPCIS_Connectors_P1_P6 (T_D2.1 T_J4.C2), DIOT_signal_routing (T_IC8.7)
BP_IO.LVDS_N0: CPCIS_Connectors_P1_P6 (T_J4.E3), DIOT_signal_routing (T_R51.1)
BP_IO.LVDS_N1: CPCIS_Connectors_P1_P6 (T_J4.B3), DIOT_signal_routing (T_R52.1)
BP_IO.LVDS_N2: CPCIS_Connectors_P1_P6 (T_J4.C4), DIOT_signal_routing (T_R53.1)
BP_IO.LVDS_N3: CPCIS_Connectors_P1_P6 (T_J4.L4), DIOT_signal_routing (T_R54.1)
BP_IO.LVDS_N4: CPCIS_Connectors_P1_P6 (T_J4.I4), DIOT_signal_routing (T_R55.1)
BP_IO.LVDS_N5: CPCIS_Connectors_P1_P6 (T_J4.K5), DIOT_signal_routing (T_R56.1)
BP_IO.LVDS_N6: CPCIS_Connectors_P1_P6 (T_J4.H5), DIOT_signal_routing (T_R57.1)
BP_IO.LVDS_N7: CPCIS_Connectors_P1_P6 (T_J4.F6), DIOT_signal_routing (T_R58.1)
BP_IO.LVDS_N8: CPCIS_Connectors_P1_P6 (T_J4.C6), DIOT_signal_routing (T_R59.1)
BP_IO.LVDS_N9: CPCIS_Connectors_P1_P6 (T_J4.L6), DIOT_signal_routing (T_R60.1)
BP_IO.LVDS_N10: CPCIS_Connectors_P1_P6 (T_J4.I6), DIOT_signal_routing (T_R61.1)
BP_IO.LVDS_N11: CPCIS_Connectors_P1_P6 (T_J5.E1), DIOT_signal_routing (T_R62.1)
BP_IO.LVDS_N12: CPCIS_Connectors_P1_P6 (T_J5.B1), DIOT_signal_routing (T_R63.1)
BP_IO.LVDS_N13: CPCIS_Connectors_P1_P6 (T_J5.K1), DIOT_signal_routing (T_R64.1)
BP_IO.LVDS_N14: CPCIS_Connectors_P1_P6 (T_J5.H1), DIOT_signal_routing (T_R65.1)
BP_IO.LVDS_N15: CPCIS_Connectors_P1_P6 (T_J4.F2), DIOT_signal_routing (T_R66.2)
BP_IO.LVDS_P0: CPCIS_Connectors_P1_P6 (T_J4.D3), DIOT_signal_routing (T_R35.1)
BP_IO.LVDS_P1: CPCIS_Connectors_P1_P6 (T_J4.A3), DIOT_signal_routing (T_R36.1)
BP_IO.LVDS_P2: CPCIS_Connectors_P1_P6 (T_J4.B4), DIOT_signal_routing (T_R37.1)
BP_IO.LVDS_P3: CPCIS_Connectors_P1_P6 (T_J4.K4), DIOT_signal_routing (T_R38.1)
BP_IO.LVDS_P4: CPCIS_Connectors_P1_P6 (T_J4.H4), DIOT_signal_routing (T_R39.1)
BP_IO.LVDS_P5: CPCIS_Connectors_P1_P6 (T_J4.J5), DIOT_signal_routing (T_R40.1)
BP_IO.LVDS_P6: CPCIS_Connectors_P1_P6 (T_J4.G5), DIOT_signal_routing (T_R41.1)
BP_IO.LVDS_P7: CPCIS_Connectors_P1_P6 (T_J4.E6), DIOT_signal_routing (T_R42.1)
BP_IO.LVDS_P8: CPCIS_Connectors_P1_P6 (T_J4.B6), DIOT_signal_routing (T_R43.1)
BP_IO.LVDS_P9: CPCIS_Connectors_P1_P6 (T_J4.K6), DIOT_signal_routing (T_R44.1)
BP_IO.LVDS_P10: CPCIS_Connectors_P1_P6 (T_J4.H6), DIOT_signal_routing (T_R45.1)
BP_IO.LVDS_P11: CPCIS_Connectors_P1_P6 (T_J5.D1), DIOT_signal_routing (T_R46.1)
BP_IO.LVDS_P12: CPCIS_Connectors_P1_P6 (T_J5.A1), DIOT_signal_routing (T_R47.1)
BP_IO.LVDS_P13: CPCIS_Connectors_P1_P6 (T_J5.J1), DIOT_signal_routing (T_R48.1)
BP_IO.LVDS_P14: CPCIS_Connectors_P1_P6 (T_J5.G1), DIOT_signal_routing (T_R49.1)
BP_IO.LVDS_P15: CPCIS_Connectors_P1_P6 (T_J4.E2), DIOT_signal_routing (T_R50.2)
EEM0_I2C.SCL: DIOT_signal_routing (T_IC8.3), Temperature_monitoring (T_IC6.1), I2C_switch (T_IC9.6), FPGA_Config (T_IC10.2)
EEM0_I2C.SDA: DIOT_signal_routing (T_IC8.2), Temperature_monitoring (T_IC6.6), I2C_switch (T_IC9.7), FPGA_Config (T_IC10.1)
FPGA_CFG.FPGA_CDONE: FPGA_Bank2-3 (T_U1.M10), FPGA_Config (T_J7.10 T_R70.1)
FPGA_CFG.FPGA_CRESET_N: FPGA_Bank2-3 (T_U1.N11), FPGA_Config (T_D7.2 T_IC14.4 T_R71.1)
FPGA_CFG.FPGA_CSBSEL0: FPGA_Bank2-3 (T_U1.K11), FPGA_Config (T_R90.1 T_SW1.8)
FPGA_CFG.FPGA_CSBSEL1: FPGA_Bank2-3 (T_U1.P13), FPGA_Config (T_R91.1 T_SW1.7)
FPGA_CFG.FPGA_SCK: FPGA_Bank2-3 (T_U1.R11), FPGA_Config (T_IC12.10)
FPGA_CFG.FPGA_SDI: FPGA_Bank2-3 (T_U1.P11), FPGA_Config (T_IC12.6)
FPGA_CFG.FPGA_SDO: FPGA_Bank2-3 (T_U1.P12), FPGA_Config (T_IC12.3)
FPGA_CFG.FPGA_SS: FPGA_Bank2-3 (T_U1.R12), FPGA_Config (T_IC12.13)
GA0: Power-up_delay (T_R31.1 T_T2.1), CPCIS_Connectors_P1_P6 (T_R13.1)
GA1: Power-up_delay (T_R32.1 T_T3.1), CPCIS_Connectors_P1_P6 (T_R14.1)
GA2: Power-up_delay (T_R33.1 T_T4.1), CPCIS_Connectors_P1_P6 (T_R16.1)
GA3: Power-up_delay (T_R34.1 T_T5.1), CPCIS_Connectors_P1_P6 (T_R18.1)
PGOOD: LEDs (T_T1.1 T_TP4.1), FPGA_Config (T_IC13.1 T_IC14.2)
PSU_EN: Power_Supplies (T_R8.1), Power-up_delay (T_IC7.1), LEDs (T_LD1.1 T_TP8.1), Temperature_monitoring (T_IC6.3)
RSTn: Power-up_delay (T_D6.1), CPCIS_Connectors_P1_P6 (T_R15.1)
SERVMOD_3V3: CPCIS_Connectors_P1_P6 (T_R17.1 T_R19.2), DIOT_signal_routing (T_IC8.5)

## Assembly variants
EEM: not fitted T_IC3 T_IC5 T_J4 T_J5 T_R2 T_R4 T_R11 T_R12 T_R35 T_R36 T_R37 T_R38 T_R39 T_R40 T_R41 T_R42 T_R43 T_R44 T_R45 T_R46 T_R47 T_R48 T_R49 T_R50 T_R51 T_R52 T_R53 T_R54 T_R55 T_R56 T_R57 T_R58 T_R59 T_R60 T_R61 T_R62 T_R63 T_R64 T_R65 T_R66; alternate parts T_R26 -> R0805_0R_JUMPER
DIOT: not fitted T_IC3 T_IC5 T_R9 T_R10